# EAGLE design mk3-schield-samtec-vias (EAGLE 9.0.1)
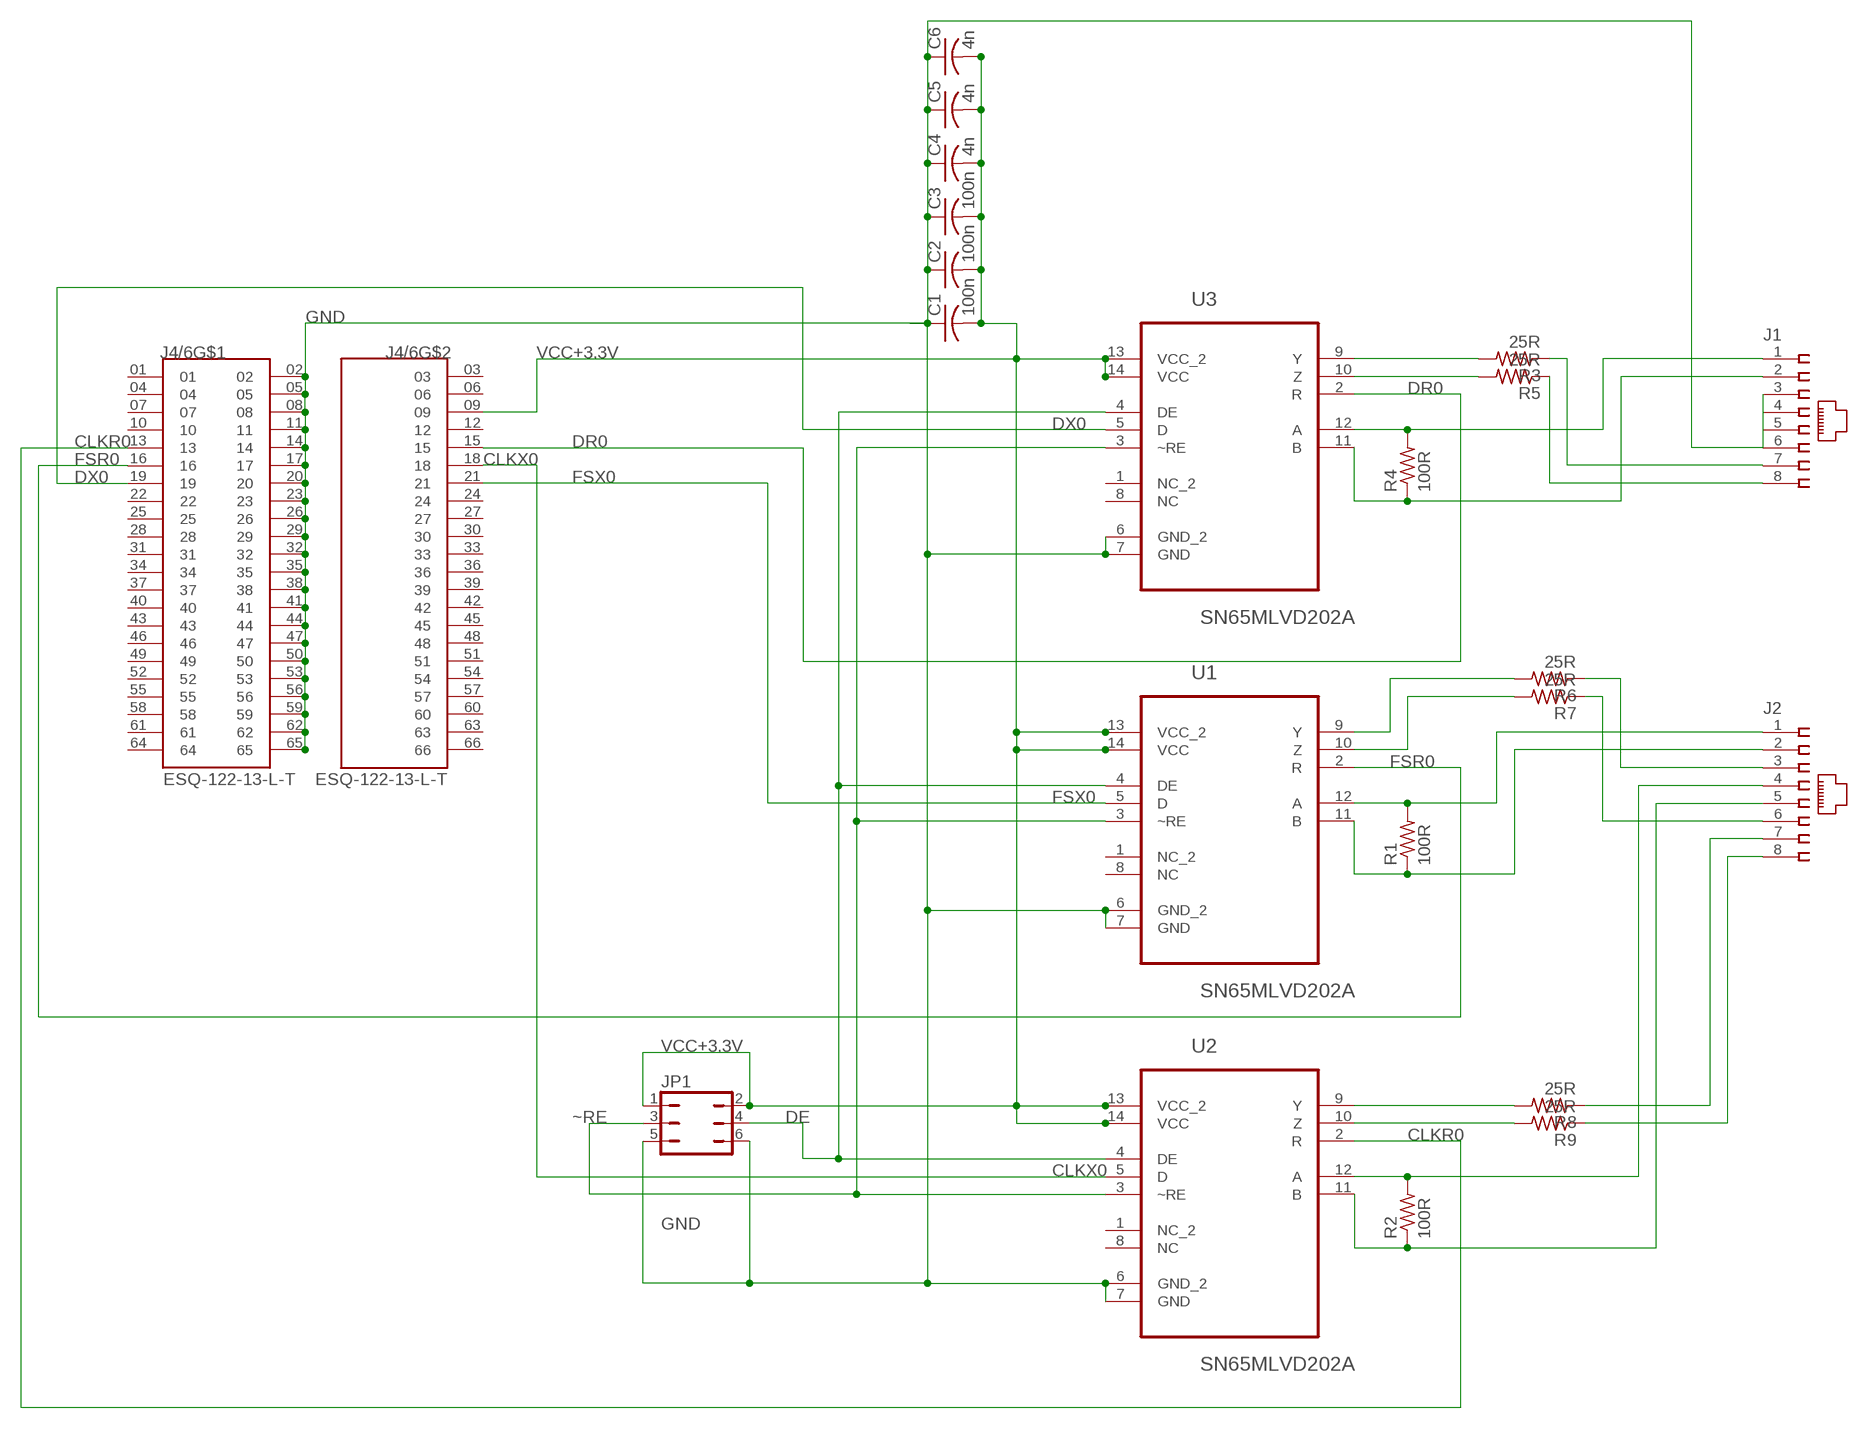
[diagram p0: schematic, sheet 1]

## Parts
C1  100n  C-USC0805  [C0805]
C2  100n  C-USC0805  [C0805]
C3  100n  C-USC0805  [C0805]
C4  4n  C-USC0805  [C0805]
C5  4n  C-USC0805  [C0805]
C6  4n  C-USC0805  [C0805]
J1  557785-1-SHIELD  [557785-1]
J2  557785-1-SHIELD  [557785-1]
J4/6  ESQ-122-13-L-T  [SAMTEC_ESQ-122-13-L-T]
JP1  JP3Q  [JP3Q]
R1  100R  R-US_R0402  [R0402]
R2  100R  R-US_R0402  [R0402]
R3  25R  R-US_R0402  [R0402]
R4  100R  R-US_R0402  [R0402]
R5  25R  R-US_R0402  [R0402]
R6  25R  R-US_R0402  [R0402]
R7  25R  R-US_R0402  [R0402]
R8  25R  R-US_R0402  [R0402]
R9  25R  R-US_R0402  [R0402]
U1  SN65MLVD202A  SN65MLVD205AD  [SOIC127P600X175-14N]
U2  SN65MLVD202A  SN65MLVD205AD  [SOIC127P600X175-14N]
U3  SN65MLVD202A  SN65MLVD205AD  [SOIC127P600X175-14N]

## Nets
CLKR0: J4/6.13 U2.2(R)
CLKX0: J4/6.18 U2.5(D)
DE: JP1.4 U1.4(DE) U2.4(DE) U3.4(DE)
DR0: J4/6.15 U3.2(R)
DX0: J4/6.19 U3.5(D)
FSR0: J4/6.16 U1.2(R)
FSX0: J4/6.21 U1.5(D)
GND: C1.1 C2.1 C3.1 C4.1 C5.1 C6.1 J1.3 J1.4 J1.5 J1.6 J4/6.02 J4/6.05 J4/6.08 J4/6.11 J4/6.14 J4/6.17 J4/6.20 J4/6.23 J4/6.26 J4/6.29 J4/6.32 J4/6.35 J4/6.38 J4/6.41 J4/6.44 J4/6.47 J4/6.50 J4/6.53 J4/6.56 J4/6.59 J4/6.62 J4/6.65 JP1.5 JP1.6 U1.6(GND_2) U1.7(GND) U2.6(GND_2) U2.7(GND) U3.6(GND_2) U3.7(GND)
N$1: J1.1 R4.2 U3.12(A)
N$2: J1.2 R4.1 U3.11(B)
N$3: J1.7 R3.1
N$4: J1.8 R5.1
N$5: J2.1 R1.2 U1.12(A)
N$6: J2.2 R1.1 U1.11(B)
N$7: J2.3 R6.1
N$8: J2.6 R7.1
N$9: J2.4 R2.2 U2.12(A)
N$10: J2.5 R2.1 U2.11(B)
N$11: J2.7 R8.1
N$12: J2.8 R9.1
N$13: R3.2 U3.9(Y)
N$14: R5.2 U3.10(Z)
N$15: R6.2 U1.9(Y)
N$16: R7.2 U1.10(Z)
N$17: R8.2 U2.9(Y)
N$18: R9.2 U2.10(Z)
VCC+3.3V: C1.2 C2.2 C3.2 C4.2 C5.2 C6.2 J4/6.09 JP1.1 JP1.2 U1.13(VCC_2) U1.14(VCC) U2.13(VCC_2) U2.14(VCC) U3.13(VCC_2) U3.14(VCC)
~RE: JP1.3 U1.3(~RE) U2.3(~RE) U3.3(~RE)
Unconnected: J4/6.01 J4/6.03 J4/6.04 J4/6.06 J4/6.07 J4/6.10 J4/6.12 J4/6.22 J4/6.24 J4/6.25 J4/6.27 J4/6.28 J4/6.30 J4/6.31 J4/6.33 J4/6.34 J4/6.36 J4/6.37 J4/6.39 J4/6.40 J4/6.42 J4/6.43 J4/6.45 J4/6.46 J4/6.48 J4/6.49 J4/6.51 J4/6.52 J4/6.54 J4/6.55 J4/6.57 J4/6.58 J4/6.60 J4/6.61 J4/6.63 J4/6.64 J4/6.66 U1.1(NC_2) U1.8(NC) U2.1(NC_2) U2.8(NC) U3.1(NC_2) U3.8(NC)

## Library data of the parts
C1-C6 = resistor:C-US: CAPACITOR, American symbol
J1 J2 = con-amp-rj45-shield:557785-1-SHIELD: AMP connector
J4/6 = ESQ-122-13-L-T:ESQ-122-13-L-T; MANUFACTURER: Samtec; PARTREV: R; STANDARD: Manufacturer Recommendations
JP1 = jumper:JP3Q: JUMPER
R1-R9 = resistor:R-US_: RESISTOR, American symbol
U1-U3 = Texas Instruments_By_element14_Batch_1:SN65MLVD205AD: MULTIPOINT-LVDS LINE DRIVER AND RECEIVER; MPN: SN65MLVD205AD; OC_FARNELL: 90H3613; OC_NEWARK: -; PACKAGE: SOIC-14; SUPPLIER: TEXAS INSTRUMENTS

## Board
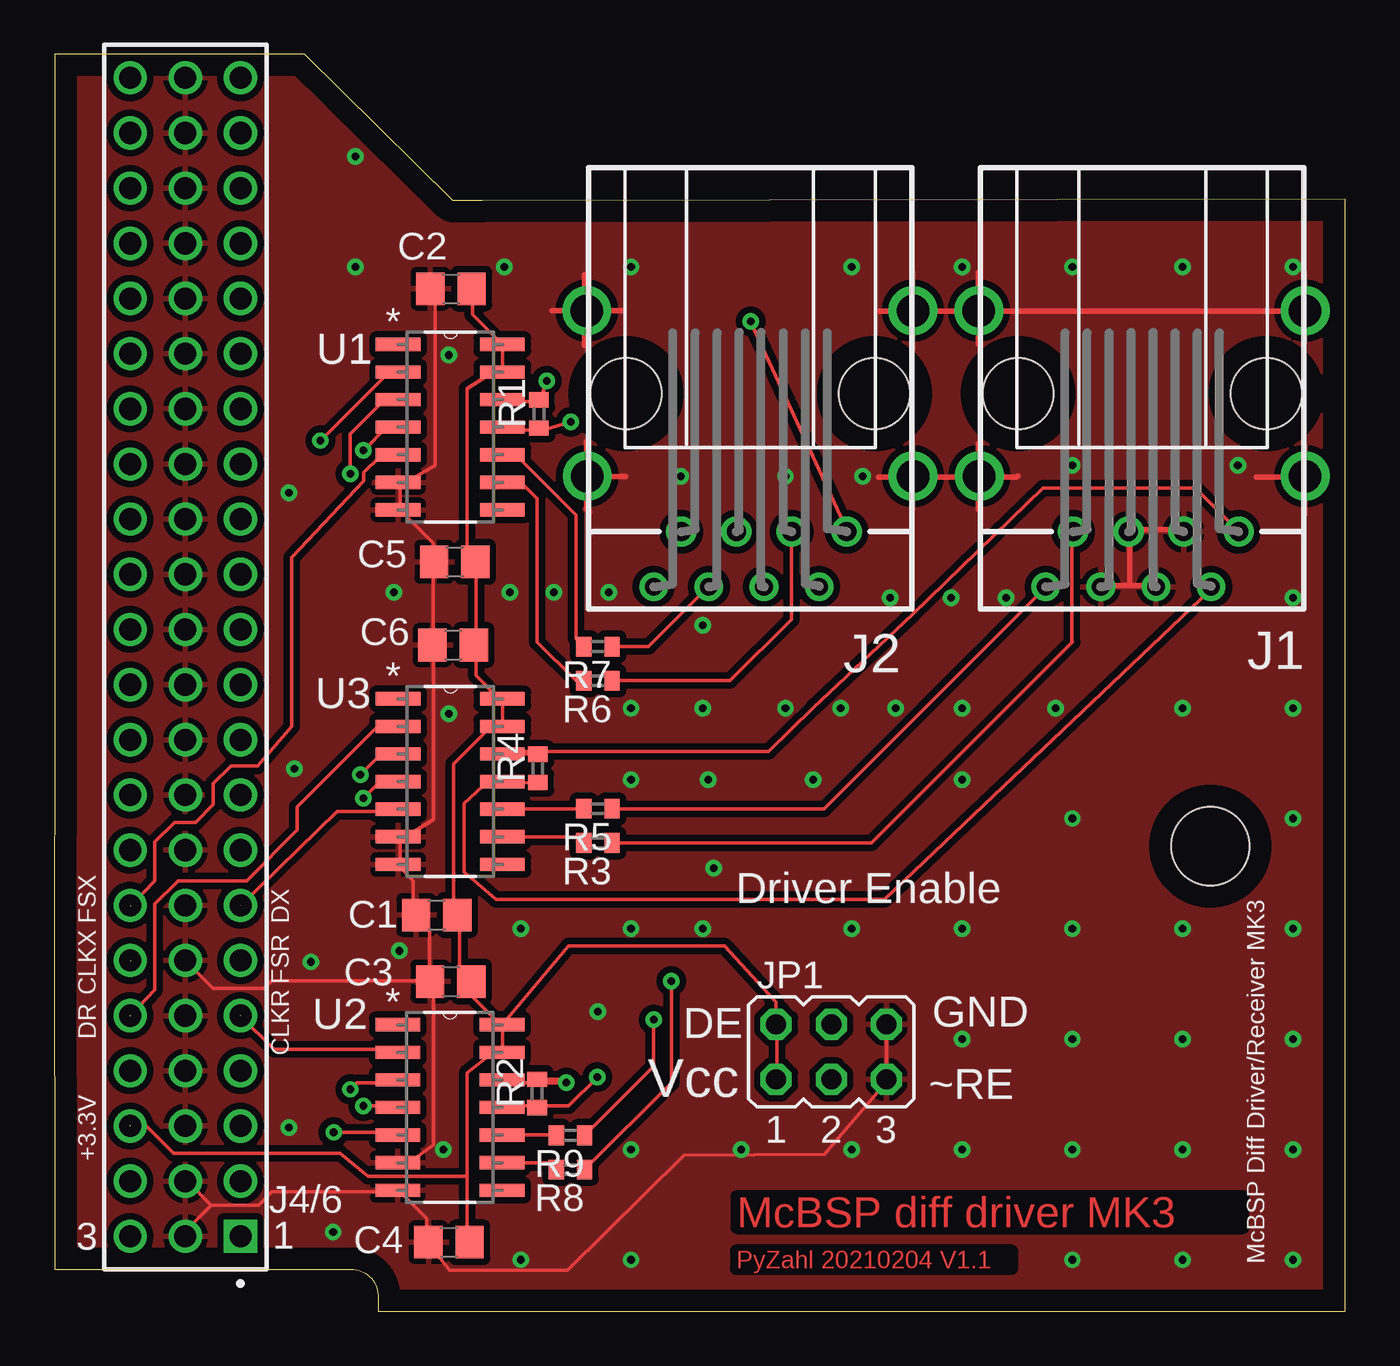
[diagram p1: board, top side]
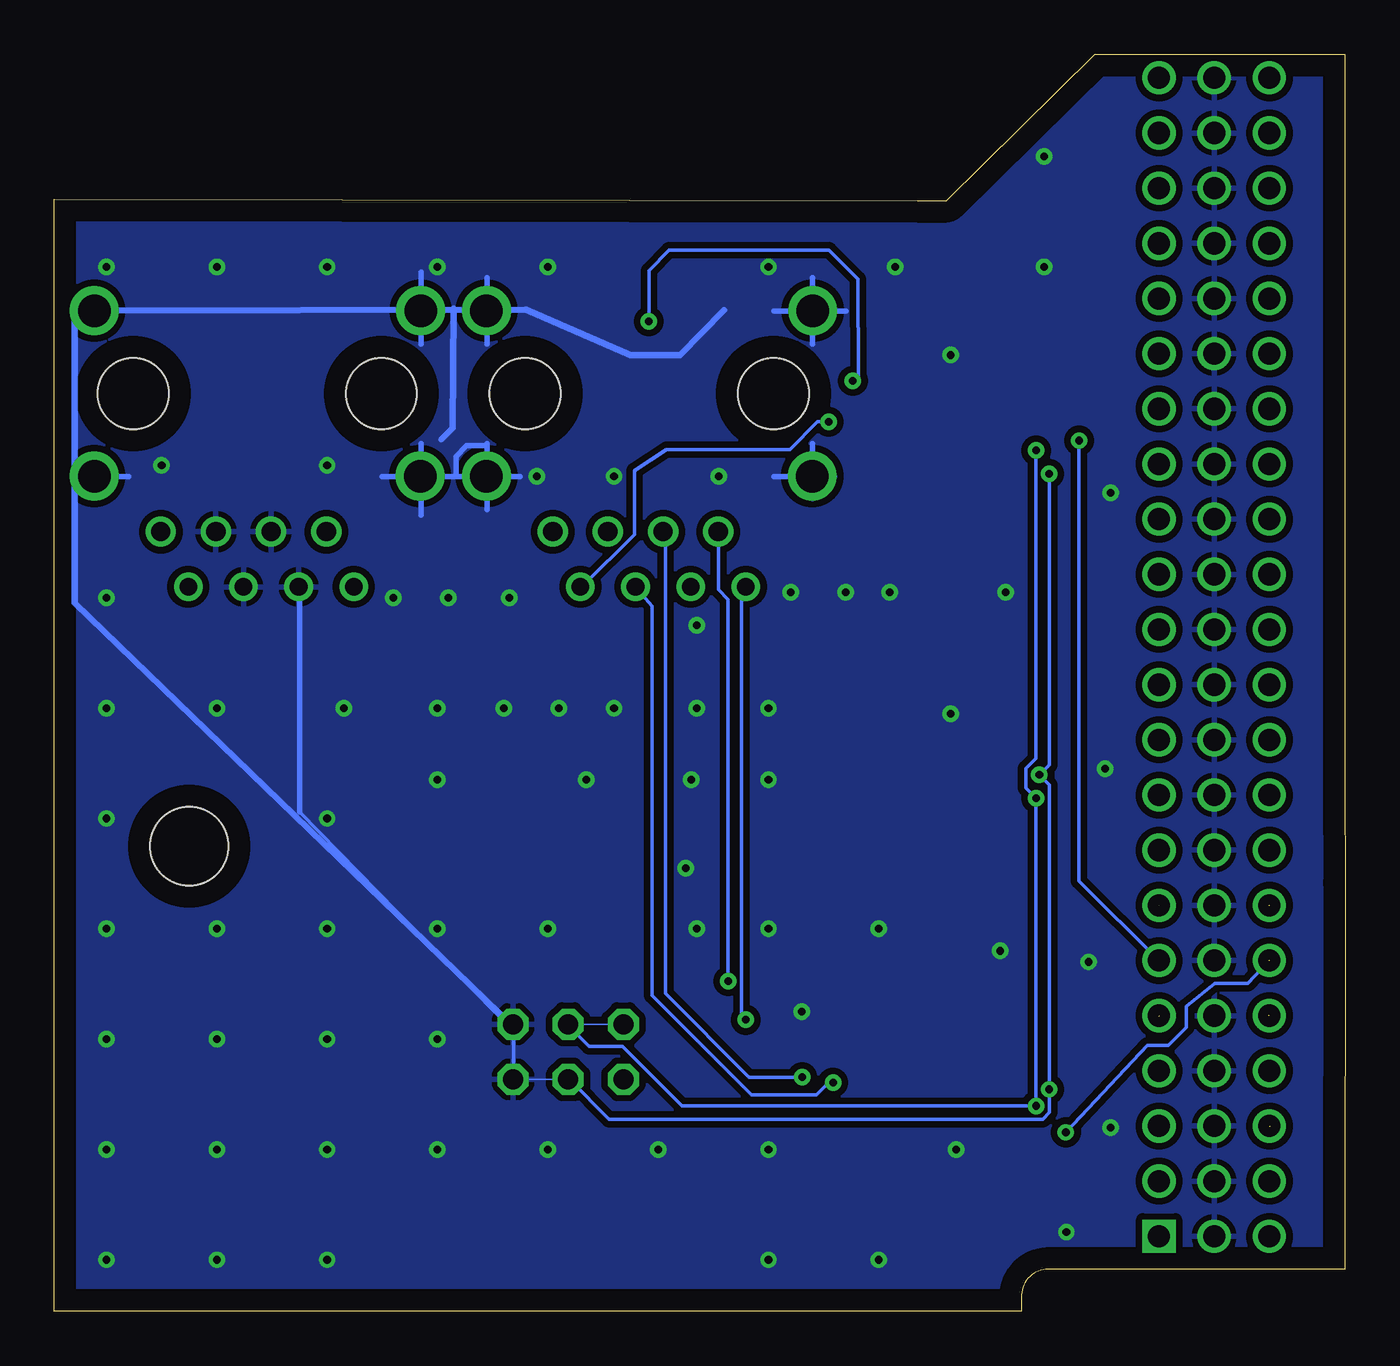
[diagram p2: board, bottom side, seen from below]

Size 59.44 x 57.88 mm. Coordinates in mm from the lower left corner, seen from the top.
Outline: 0.03,1.93 0.03,1.93 0.03,1.93 13.66,1.94 arc-94 14.91,0.65 14.91,0 59.44,0.01 59.44,51.22 19.7,51.15 18.37,51.15 11.52,57.88 0.01,57.88 0.01,24.1 0,19.73 0.03,1.93
Copper layers (1*16): Top 0.035mm / dielectric 1.5mm / Bottom 0.035mm
Design rules "default": minimum track width 6mil, minimum drill 0.35mm, track to track 6mil, track to pad 6mil, pad to pad 6mil, via to via 6mil, smd to smd 6mil, copper to edge 40mil, drill to drill 6mil, minimum pad ring 10mil, minimum via ring 8mil, stop-mask expansion 4mil, vias tented up to drill 0mil, thermal gap 10mil
Holes 3.6 mm at 53.22,21.43

### Footprints (pad centres in the part's own frame; a part is rotated, then mirrored left to right if it is on the bottom)
C0805 = smd 1.3 x 1.5: 1 -0.95,0; 2 0.95,0
557785-1 = drill 0.889: 1 -4.445,6.35; 3 -1.905,6.35; 5 0.635,6.35; 7 3.175,6.35 | drill 0.813: 2 -3.175,8.89; 4 -0.635,8.89; 6 1.905,8.89; 8 4.445,8.89 | drill 1.5: P$1 -7.5,3.8; P$2 7.5,3.8; P$3 -7.5,-3.82; P$4 7.526,-3.821 | hole 3.251: -5.715,0; 5.715,0
SAMTEC_ESQ-122-13-L-T = drill 1.02 pad 1.37 square: 01 0,0 | drill 1.02 pad 1.37: 02 0,2.54; 03 0,5.08; 04 2.54,0; 05 2.54,2.54; 06 2.54,5.08; 07 5.08,0; 08 5.08,2.54; 09 5.08,5.08; 10 7.62,0; 11 7.62,2.54; 12 7.62,5.08; 13 10.16,0; 14 10.16,2.54; 15 10.16,5.08; 16 12.7,0; 17 12.7,2.54; 18 12.7,5.08; 19 15.24,0; 20 15.24,2.54; 21 15.24,5.08; 22 17.78,0; 23 17.78,2.54; 24 17.78,5.08; 25 20.32,0; 26 20.32,2.54; 27 20.32,5.08; 28 22.86,0; 29 22.86,2.54; 30 22.86,5.08; 31 25.4,0; 32 25.4,2.54; 33 25.4,5.08; 34 27.94,0; 35 27.94,2.54; 36 27.94,5.08; 37 30.48,0; 38 30.48,2.54; 39 30.48,5.08; 40 33.02,0; 41 33.02,2.54; 42 33.02,5.08; 43 35.56,0; 44 35.56,2.54; 45 35.56,5.08; 46 38.1,0; 47 38.1,2.54; 48 38.1,5.08; 49 40.64,0; 50 40.64,2.54; 51 40.64,5.08; 52 43.18,0; 53 43.18,2.54; 54 43.18,5.08; 55 45.72,0; 56 45.72,2.54; 57 45.72,5.08; 58 48.26,0; 59 48.26,2.54; 60 48.26,5.08; 61 50.8,0; 62 50.8,2.54; 63 50.8,5.08; 64 53.34,0; 65 53.34,2.54; 66 53.34,5.08
JP3Q = drill 0.914 octagon: 1 -2.54,-1.27; 2 -2.54,1.27; 3 0,-1.27; 4 0,1.27; 5 2.54,-1.27; 6 2.54,1.27
R0402 = smd 0.7 x 0.9: 1 -0.65,0; 2 0.65,0
SOIC127P600X175-14N = smd 2.057 x 0.61: 1 -4.801,7.62; 2 -4.801,6.35; 3 -4.801,5.08; 4 -4.801,3.81; 5 -4.801,2.54; 6 -4.801,1.27; 7 -4.801,0; 8 0,0; 9 0,1.27; 10 0,2.54; 11 0,3.81; 12 0,5.08; 13 0,6.35; 14 0,7.62

### Placement (x,y rotation side)
C1  17.61,18.26 0 top
C2  18.26,47.09 0 top
C3  18.25,15.19 0 top
C4  18.17,3.19 0 top
C5  18.44,34.52 0 top
C6  18.36,30.69 0 top
J1  50.09,42.26 180 top
J2  32.04,42.26 180 top
J4/6  8.57,3.46 90 top
JP1  35.77,11.95 0 top
R1  22.32,41.32 90 top
R2  22.23,10.04 90 top
R3  25.03,21.57 180 top
R4  22.27,25.01 90 top
R5  25.03,23.15 180 top
R6  25.03,29.04 180 top
R7  25.03,30.61 180 top
R8  23.76,6.54 180 top
R9  23.76,8.11 180 top
U1  20.63,36.91 0 top
U2  20.61,5.58 0 top
U3  20.63,20.59 0 top

### Tracks (layer width: path | path; a pad name or v marks a point on that pad's centre or on a via)
CLKR0  (1 unrouted)
  Top 0.152: J4/6.13 10.12,12.06 15.76,12.06 U2.2
CLKX0  (via drill 0.35)  (1 unrouted)
  Top 0.152: v12.86,8.25 15.76,8.25 U2.5
  Bottom 0.152: v12.86,8.25 9.1,12.26 8.14,12.26 7.33,13.07 7.33,14.04 6,15.1 4.48,15.1 3.51,16.14
DE  (via drill 0.35)
  Top 0.152: v14.23,9.47 15.76,9.47 U2.4 | v14.23,23.64 14.84,24.25 15.76,24.25 U3.4 | v14.23,39.64 15.3,40.71 15.76,40.71 U1.4
  Bottom 0.152: JP1.4 35.72,13.12 34.81,12.21 33.28,12.21 30.54,9.47 v14.23,9.47 v14.23,23.64 14.69,24.1 14.69,25.01 14.23,25.47 v14.23,39.64
DR0  (1 unrouted)
  Top 0.152: 3.52,13.64 4.63,14.8 4.63,18.76 5.7,19.83 8.85,19.83 11.19,22.17 11.19,23.23 14.79,26.84 15.76,26.84 U3.2
DX0  (1 unrouted)
  Top 0.152: 8.57,18.68 13.02,23.03 15.76,23.03 U3.5
FSR0  (via drill 0.35)
  Top 0.152: v12.25,40.1 15.3,43.15 15.76,43.15 U1.2
  Bottom 0.152: v12.25,40.1 12.25,19.83 J4/6.16
FSX0  (1 unrouted)
  Top 0.152: 3.53,18.68 4.63,19.83 4.63,21.61 5.55,22.52 6.51,22.52 7.33,23.33 7.33,24.3 8.14,25.11 9.36,25.11 10.93,26.94 10.93,34.71 14.24,38.24 14.25,38.62 14.97,39.33 15.76,39.34 U1.5
GND  (via drill 0.35)
  Top 0.152: C3.1 17.28,15.26 17.28,17.54 16.67,18.15 C1.1 16.52,18.3 16.52,19.83 15.91,20.44 U3.7 15.91,20.59 15.91,21.81 U3.6 15.91,21.96 16.37,21.96 17.46,22.65 17.46,30.42 C6.1 17.43,30.8 17.43,34.46 C5.1 17.43,34.61 17.43,35.37 15.91,36.9 U1.7 15.91,37.05 15.91,38.12 U1.6 15.91,38.27 16.37,38.27 17.54,38.95 17.54,46.73 C2.1 | C3.1 17.46,14.98 17.46,7.66 16.37,6.87 15.91,6.87 U2.6 15.76,6.87 | JP1.6 JP1.5 38.31,10.57 35.46,7.22 29,7.19 23.63,1.9 18.2,1.9 17.28,3.06 C4.1 17.13,3.22 17.13,4.28 15.91,5.5 U2.7 15.76,5.5 10.02,5.5 9.41,4.89 7.22,4.89 | 6.16,5.96 7.22,4.89 | 6.16,3.52 6.16,3.83 7.22,4.89 | 48.3,33.42 J1.6 | 50.58,33.42 J1.4 | 49.52,36.01 J1.5 49.52,35.86 | 51.95,36.01 J1.3 | C3.1 17.28,15.22 10.01,15.22 9.68,14.88 7.31,14.88 J4/6.17
  Top 0.254: 50.58,33.42 49.52,33.42 | 49.52,33.42 48.3,33.42 | 51.95,36.01 49.52,36.01 | 49.52,35.86 49.52,33.42 | 24.42,47.74 24.42,44.49 24.45,44.46 | 22.93,46.08 26.12,46.08 | 26.31,38.44 23.62,38.44 23.59,38.42 | 24.5,40.04 24.5,36.95 24.63,36.82 | 57.54,47.64 57.54,44.6 | 57.57,39.81 57.57,36.71 | 37.95,38.42 44.31,38.42 44.36,38.47 | 55.34,38.43 58.54,38.43 | 37.98,46.07 57.54,46.07 | 39.51,44.29 39.51,47.84 | 42.56,44.54 42.56,47.84 | 39.51,39.97 39.51,36.92 | 42.56,39.97 42.56,36.92 | 57.54,47.84 57.54,45.81
  Bottom 0.076: 36.39,10.68 37.69,10.68 JP1.5 arc90 JP1.5
  Bottom 0.152: 48.14,23 38.29,12.89 38.29,11.42 38.24,10.71 JP1.5 | 48.14,33.26 J1.6
  Bottom 0.254: 48.14,23 48.14,33.26 | 26.3,46.07 23,46.07 | 24.52,47.59 24.52,44.54 | 24.52,39.97 24.52,37.43 | 26.3,38.45 23.51,38.45 | 39.51,47.59 39.51,44.54 | 42.56,47.84 42.56,44.54 | 39.51,36.92 39.51,39.97 39.62,39.86 40.46,39.86 40.94,39.37 40.94,38.45 | 42.56,39.97 42.56,36.67 | 37.98,38.45 40.94,38.45 | 40.94,38.45 44.33,38.45 | 56.02,38.45 58.56,38.45 | 41.63,40.13 41.09,40.67
  Bottom 0.305: 28.61,46.11 30.62,44.03 32.9,44.03 37.73,46.12 58.51,46.09 58.51,32.63 38.24,13.05 | 41.06,46.16 41.09,40.67
  other vias: 57.03,2.38 57.03,7.46 57.03,12.54 57.03,17.62 57.03,22.7 57.03,27.78 57.03,32.86 51.95,2.38 51.95,7.46 51.95,12.54 51.95,17.62 51.95,27.78 46.87,17.62 46.87,12.54 46.87,7.46 46.87,2.38 41.79,7.46 36.71,7.46 31.63,7.46 26.55,7.46 26.55,2.38 21.47,2.38 41.79,17.62 41.79,12.54 36.71,17.62 26.55,17.62 21.47,17.62 46.87,22.7 41.79,27.78 34.94,24.48 26.55,27.78 57.03,48.1 51.95,48.1 46.87,48.1 41.79,48.1 36.71,48.1 26.55,48.1 13.85,48.1 13.85,53.18 28.84,38.45 33.67,38.45 46.87,38.95 54.49,38.95 46.11,27.78 41.79,24.48 29.86,27.78 30.11,24.48 29.86,17.62 25.03,13.81 15.89,16.6 11.82,16.09 12.84,3.65 18.17,27.52 15.63,33.11 20.97,33.11 20.71,48.1 18.17,44.03 11.06,24.98 10.81,37.68 10.81,8.47 38.49,32.86 26.55,24.48 30.36,20.41 38.75,27.78 36.21,27.78 43.83,32.86 41.29,32.86 33.67,27.78 25.54,33.11 29.86,31.59 23,33.11 37.22,38.45 17.92,7.46
  pour Top (isolate 0.305): -0.37,58.51 59.83,58.51 59.83,-0.67 -0.62,-0.67 -0.62,58.51
  pour Bottom (isolate 0.305): 60.08,-0.42 60.08,58.77 -0.37,58.77 -0.37,-0.42
N$1
  Top 0.152: J1.1 54.47,35.98 52.54,37.91 45.53,37.91 39.51,32.1 34.94,27.78 32.88,25.77 20.64,25.77 U3.12 20.66,25.63 R4.2
N$2
  Top 0.152: J1.2 53.25,33.24 38.21,18.96 20.33,18.96 18.86,20.23 18.86,23.38 20,24.43 20.48,24.25 U3.11 20.69,24.33 R4.1
N$3
  Top 0.152: J1.7 46.85,35.83 46.85,30.85 46.87,30.83 37.62,21.57 R3.1
N$4
  Top 0.152: 45.63,33.24 J1.8 35.43,23.15 R5.1
N$5  (via drill 0.35)
  Top 0.152: v22.67,42.84 22.41,42.08 22.09,41.89 | v32.07,45.58 36.48,35.98 J2.1 | 22.09,41.89 20.73,41.89 U1.12 | R1.2 22.09,41.89
  Bottom 0.152: v22.67,42.84 22.41,43.09 22.44,47.52 23.76,48.86 31.13,48.86 32.07,47.92 v32.07,45.58
N$6  (via drill 0.35)
  Top 0.152: v23.78,40.96 22.24,40.48 21.87,40.59 | 21.87,40.59 21.36,40.59 21.24,40.71 20.64,40.71 U1.11 | R1.1 21.87,40.59
  Bottom 0.152: v23.78,40.96 24.29,40.96 25.56,39.69 31.25,39.69 32.73,38.73 32.73,35.78 35.11,33.39 J2.2
N$7
  Top 0.152: R6.1 31.12,29.04 33.95,31.87 J2.3
N$8
  Top 0.152: 30.08,33.39 30.11,33.38 | 30.11,33.38 J2.6 | R7.1 27.35,30.61 30.11,33.38
N$9  (via drill 0.35)
  Top 0.152: U2.12 20.64,10.53 v23.58,10.53 23.43,10.69 R2.2
  Bottom 0.152: v23.58,10.53 23.78,10.53 24.34,9.97 27.34,9.97 31.91,14.55 31.91,32.48 J2.4
N$10  (via drill 0.35)
  Top 0.152: 22.31,9.47 20.64,9.47 U2.11 | v25,10.79 23.68,9.47 22.31,9.47 | R2.1 22.31,9.47
  Bottom 0.152: v25,10.79 27.44,10.79 31.3,14.65 31.3,35.83 J2.5
N$11  (via drill 0.35)
  Top 0.152: R8.1 28.41,10.53 v28.41,15.21
  Bottom 0.152: v28.41,15.21 28.41,32.78 28.86,33.24 28.86,35.83 J2.7
N$12  (via drill 0.35)
  Top 0.152: R9.1 27.59,11.29 v27.59,13.43
  Bottom 0.152: v27.59,13.43 27.8,13.38 27.8,33.09 27.65,33.24 J2.8
N$13
  Top 0.152: U3.9 24.1,21.86 R3.2
N$14
  Top 0.152: U3.10 24.36,23.13 R5.2
N$15
  Top 0.152: U1.9 21.49,38.18 22.24,37.43 22.24,30.83 24.02,29.04 R6.2
N$16
  Top 0.152: U1.10 21.24,39.45 24.01,36.67 24.01,30.98 R7.2
N$17
  Top 0.152: U2.9 22.79,6.85 R8.2
N$18
  Top 0.152: U2.10 23.1,8.12 R9.2
VCC
  Bottom 0.076: 33.86,13.21 35.13,13.21
VCC+3.3V  (1 unrouted)
  Top 0.152: 19.01,6.21 19.01,10.99 20.18,11.9 20.48,11.9 U2.13 20.64,12.06 20.64,13.12 U2.14 | 19.01,6.21 19.01,3.22 C4.2 | 3.48,8.53 4.25,8.52 5.5,7.28 13.17,7.28 14.44,6.21 19.01,6.21 | C2.2 19.26,46.96 19.26,45.89 20.48,44.67 U1.14 20.64,43.3 U1.13 20.48,43.15 20.03,43.15 19.01,42.49 19.01,34.71 C5.2 19.42,34.46 19.42,30.8 C6.2 19.42,30.65 19.42,29.28 20.48,28.21 U3.14 20.64,28.06 20.64,26.99 U3.13 20.48,26.84 20.03,26.84 18.37,25.21 18.37,18.94 C1.2 18.65,18.15 18.65,15.71 19.11,15.26 C3.2 19.26,15.1 19.26,14.49 20.48,13.28 U2.14 | JP1.1 33.28,10.68 33.28,13.12 JP1.2 33.23,14.24 33.16,14.32 30.85,16.83 23.68,16.83 U2.14
~RE  (via drill 0.35)
  Top 0.152: v13.62,10.23 13.93,10.53 15.76,10.53 U2.3 | v14.08,24.71 15,25.62 15.76,25.62 U3.3 | v13.62,38.57 13.62,40.4 15.15,41.93 15.76,41.93 U1.3
  Bottom 0.152: JP1.3 35.72,10.68 33.89,8.86 13.93,8.86 13.62,9.16 v13.62,10.23 13.62,24.25 v14.08,24.71 13.62,25.16 v13.62,38.57

### Text on the board
Top: McBSP diff driver MK3 | PyZahl 20210204 V1.1
tPlace: Driver Enable | GND | DE | Vcc | ~RE
tNames: FSX | DX | FSR | CLKX | DR | CLKR | +3.3V | 3 | 1 | McBSP Diff Driver/Receiver MK3
205bmp: /home/pzahl/BNLBox/RedPitayaPAC/Extension_connector.bmp